# Altium schematic sheet PROC.SchDoc
size A3; CompanyName: HESSO; Address1: Route du Rawyl 47; Address2: 1950 Sion; Address3: Switzerland; SheetNumber: 2; SheetTotal: 4; PageSetup: Record=PageOptions|CenterHorizontal=True|CenterVertical=True|PrintScale=1.00|XCorrection=1.00|YCorrection=1.00|PrintKind=1|BorderSize=5000000|LeftOffset=0|BottomOffset=0|Orientation=2|PaperLength=1000|PaperWidth=1000|Scale=100|PaperSource=15|PrintQuality=1200|MediaType=1|DitherType=10|PrintScaleMode=1|PaperKind=A4|PaperIndex=9; ProjectName: Project Name
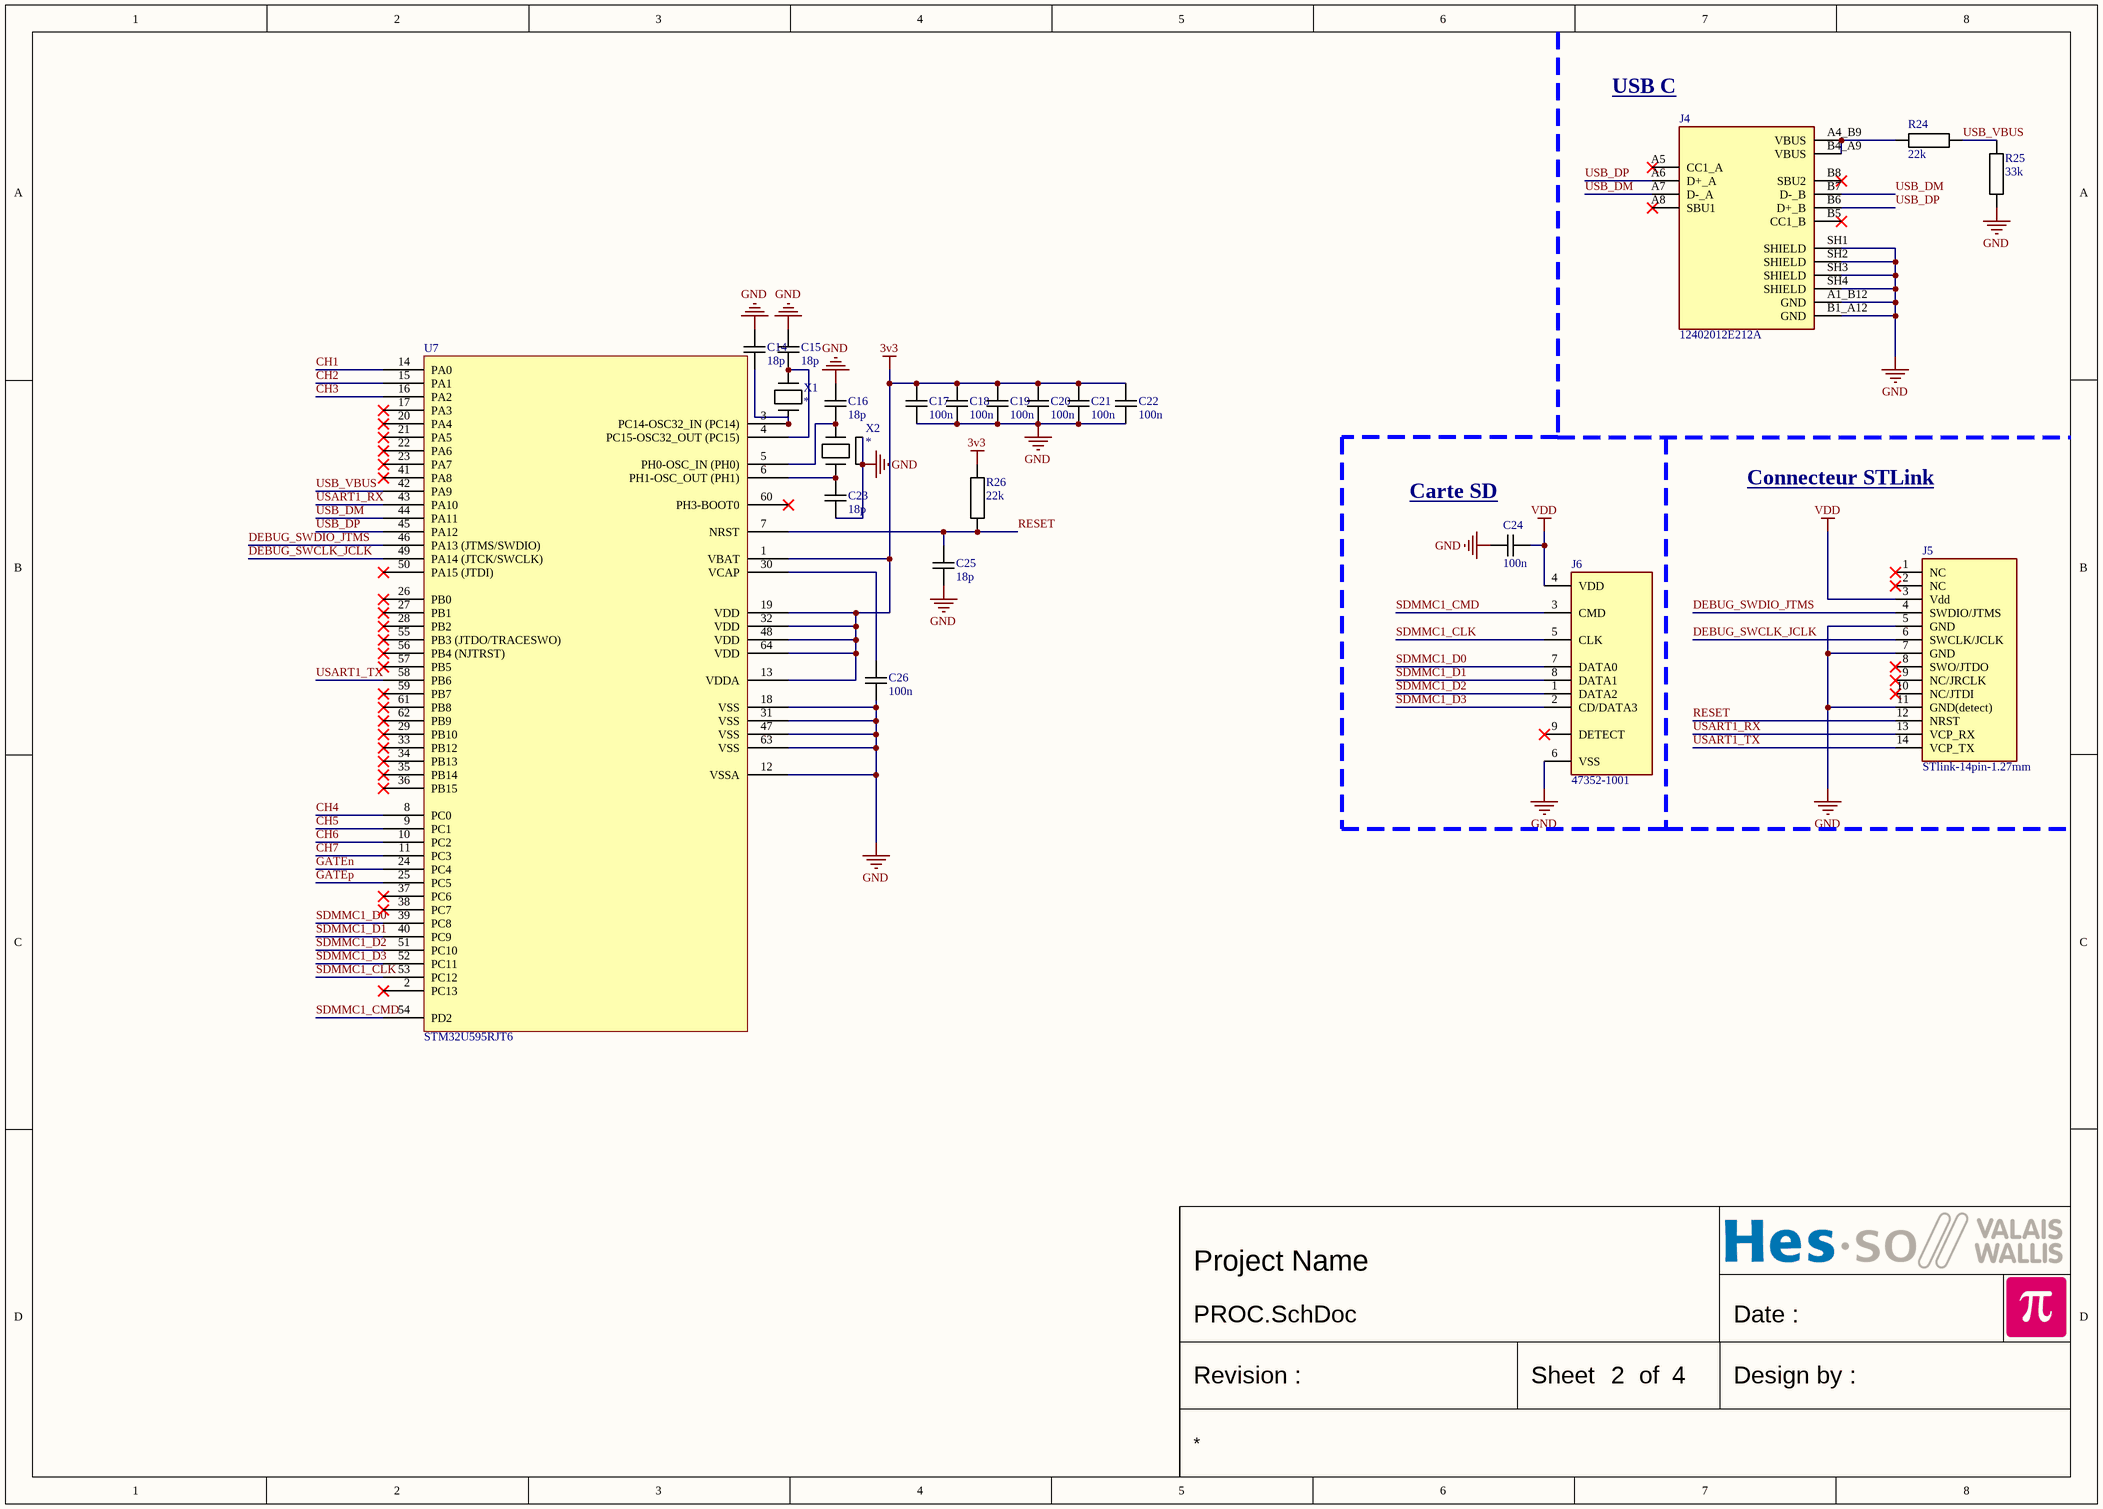
[diagram p0: PROC.SchDoc]

## Parts
C14  18p  [CAPACITOR 1005 REFLOW]
C15  18p  [CAPACITOR 1005 REFLOW]
C16  18p  [CAPACITOR 1005 REFLOW]
C17  100n  [CAPACITOR 1005 REFLOW]
C18  100n  [CAPACITOR 1005 REFLOW]
C19  100n  [CAPACITOR 1005 REFLOW]
C20  100n  [CAPACITOR 1005 REFLOW]
C21  100n  [CAPACITOR 1005 REFLOW]
C22  100n  [CAPACITOR 1005 REFLOW]
C23  18p  [CAPACITOR 1005 REFLOW]
C24  100n  [CAPACITOR 1005 REFLOW]
C25  18p  [CAPACITOR 1005 REFLOW]
C26  100n  [CAPACITOR 1005 REFLOW]
J4  12402012E212A  [USB-C-SMD Amphenol 12402012E212A]
J5  STlink-14pin-1.27mm  [FTSH-107-01-S-D-K]
J6  47352-1001  [SD MICRO MOLEX 47352-1001]
R24  22k  [RESISTOR 1005 REFLOW]
R25  33k  [RESISTOR 1005 REFLOW]
R26  22k  [RESISTOR 1005 REFLOW]
U7  STM32U595RJT6  [TSQFP50P1200X1200X160-64N]
X1  *  [Crystal C3.2x1.5 Abracon ABS07]
X2  *  [Crystal C2.0x1.6 Kyocera CX2016DB]

## Nets
3v3: C17.1 C18.1 C19.1 C20.1 C21.1 C22.1 R26.2 U7.1(VBAT) U7.13(VDDA) U7.19(VDD) U7.32(VDD) U7.48(VDD) U7.64(VDD)
GND: C14.1 C15.1 C16.1 C17.2 C18.2 C19.2 C20.2 C21.2 C22.2 C23.2 C24.2 C25.2 C26.2 J4.A1_B12(GND) J4.B1_A12(GND) J4.SH1(SHIELD) J4.SH2(SHIELD) J4.SH3(SHIELD) J4.SH4(SHIELD) J5.5(GND) J5.7(GND) J5.11(GND(detect)) J6.6(VSS) R25.1 U7.12(VSSA) U7.18(VSS) U7.31(VSS) U7.47(VSS) U7.63(VSS) X2.2 X2.4
VDD: C24.1 J5.3(Vdd) J6.4(VDD)
CH1: U7.14(PA0)
CH2: U7.15(PA1)
CH3: U7.16(PA2)
CH4: U7.8(PC0)
CH5: U7.9(PC1)
CH6: U7.10(PC2)
CH7: U7.11(PC3)
DEBUG_SWCLK_JCLK: J5.6(SWCLK/JCLK) U7.49(PA14_(JTCK/SWCLK))
DEBUG_SWDIO_JTMS: J5.4(SWDIO/JTMS) U7.46(PA13_(JTMS/SWDIO))
GATEn: U7.24(PC4)
GATEp: U7.25(PC5)
RESET: C25.1 J5.12(NRST) R26.1 U7.7(NRST)
SDMMC1_CLK: J6.5(CLK) U7.53(PC12)
SDMMC1_CMD: J6.3(CMD) U7.54(PD2)
SDMMC1_D0: J6.7(DATA0) U7.39(PC8)
SDMMC1_D1: J6.8(DATA1) U7.40(PC9)
SDMMC1_D2: J6.1(DATA2) U7.51(PC10)
SDMMC1_D3: J6.2(CD/DATA3) U7.52(PC11)
USART1_RX: J5.13(VCP_RX) U7.43(PA10)
USART1_TX: J5.14(VCP_TX) U7.58(PB6)
USB_DM: J4.A7(D-_A) J4.B7(D-_B) U7.44(PA11)
USB_DP: J4.A6(D+_A) J4.B6(D+_B) U7.45(PA12)
USB_VBUS: R24.2 R25.2 U7.42(PA9)
NetC14_2: C14.2 U7.3(PC14-OSC32_IN_(PC14)) X1.1
NetC15_2: C15.2 U7.4(PC15-OSC32_OUT_(PC15)) X1.2
NetC16_2: C16.2 U7.5(PH0-OSC_IN_(PH0)) X2.3
NetC23_1: C23.1 U7.6(PH1-OSC_OUT_(PH1)) X2.1
NetC26_1: C26.1 U7.30(VCAP)
NetJ4_A4_B9: J4.A4_B9(VBUS) J4.B4_A9(VBUS) R24.1

Not connected (* = marked no-connect by the designer): J4 A5(CC1_A)* A8(SBU1)* B5(CC1_B)* B8(SBU2)*; J5 1(NC)* 2(NC)* 8(SWO/JTDO)* 9(NC/JRCLK)* 10(NC/JTDI)*; J6 9(DETECT)*; U7 2(PC13)* 17(PA3)* 20(PA4)* 21(PA5)* 22(PA6)* 23(PA7)* 26(PB0)* 27(PB1)* 28(PB2)* 29(PB10)* 33(PB12)* 34(PB13)* 35(PB14)* 36(PB15)* 37(PC6)* 38(PC7)* 41(PA8)* 50(PA15_(JTDI))* 55(PB3_(JTDO/TRACESWO))* 56(PB4_(NJTRST))* 57(PB5)* 59(PB7)* 60(PH3-BOOT0)* 61(PB8)* 62(PB9)*

## Notes on the sheet
- (near J4) USB C
- (near C24) Carte SD
- Connecteur STLink
- Date :
- Revision :
- Sheet
- of
- Design by :

## Library data of the parts
C14-C26 = Capacitor
  C14-C16 C23 C25: Value: 18p
  C17-C22 C24 C26: Value: 100n
J4 = USB-C-SMD Amphenol 12402012E212A: Value: 12402012E212A
J6 = SD-MICRO MOLEX 47352-1001: SD Card  Micro; Value: 47352-1001
R24-R26 = Resistor
  R24 R26: Value: 22k
  R25: Value: 33k
X1 = Crystal C3.2x1.5 Abracon ABS07: Value: *
X2 = Crystal C2.0x1.6 Kyocera CX2016DB: Value: *
J5 = STlink-14pin-1.27mm: Value: STlink-14pin-1.27mm